# Altium schematic sheet CLKB_RS232_port.SchDoc
size A
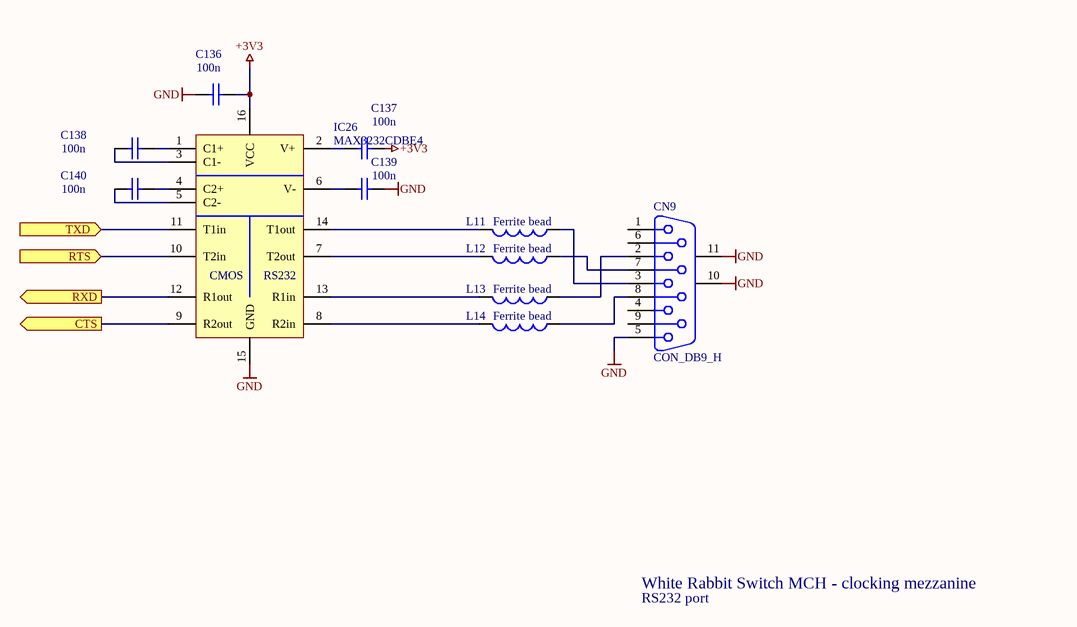
[diagram p0: CLKB_RS232_port.SchDoc]

## Parts
C136  100n  [CAPC1608X87N]
C137  100n  [CAPC1608X87N]
C138  100n  [CAPC1608X87N]
C139  100n  [CAPC1608X87N]
C140  100n  [CAPC1608X87N]
CN9  CON_DB9_H  [DSUB_MINI_9]
IC26  MAX3232CDBE4  [SSOP16]
L11  Ferrite bead  [L0603]
L12  Ferrite bead  [L0603]
L13  Ferrite bead  [L0603]
L14  Ferrite bead  [L0603]

## Ports
CTS (out), RTS (in), RXD (out), TXD (in)

## Nets
+3V3: C136.2 C137.2 IC26.16(VCC)
GND: C136.1 C139.2 CN9.5 CN9.10(MH1) CN9.11(MH2) IC26.15(GND)
CTS: IC26.9(R2out) ; port CTS
RTS: IC26.10(T2in) ; port RTS
RXD: IC26.12(R1out) ; port RXD
TXD: IC26.11(T1in) ; port TXD
NetC137_1: C137.1 IC26.2(V+)
NetC138_1: C138.1 IC26.3(C1-)
NetC138_2: C138.2 IC26.1(C1+)
NetC139_1: C139.1 IC26.6(V-)
NetC140_1: C140.1 IC26.5(C2-)
NetC140_2: C140.2 IC26.4(C2+)
NetCN9_2: CN9.2 L13.1
NetCN9_3: CN9.3 L11.1
NetCN9_7: CN9.7 L12.1
NetCN9_8: CN9.8 L14.1
NetIC26_7: IC26.7(T2out) L12.2
NetIC26_8: IC26.8(R2in) L14.2
NetIC26_13: IC26.13(R1in) L13.2
NetIC26_14: IC26.14(T1out) L11.2

Not connected (* = marked no-connect by the designer): CN9 1 4 6 9

## Notes on the sheet
- White Rabbit Switch MCH - clocking mezzanine
- RS232 port
- (in symbol IFC_MAX3232) CMOS; RS232

## Library data of the parts
C136-C140 = CC0603_100NF_50V_10%_X7R: Non-polarised capacitor; Part Description: SMD Multilayer Chip Ceramic Capacitor; Manufacturer: GENERIC; Manufacturer1 Part Number: 223858615649; Manufacturer1 Datasheet: \\cern.ch\dfs\Applications\Altium\Datasheets\CC0603_X7R_PHYCOMP.pdf; Value: 100nF; Voltage: 50V; TC: X7R; Tolerance: ±10%; Table: Capacitors SMD; Part Number: CC0603_100NF_50V_10%_X7R; Component Kind: Standard; Component Type: Standard; Designator: Capacitor - non polarized; Library Reference: Capacitor - non polarized; Pin Count: 2; Status: Preferred; Manufacturer Part Number: CC0603_100NF_50V_10%_X7R; Case: 0603; Mounted: Yes; Socket: No; SMD: Yes; Manufacturer1 Example: PHYCOMP; Manufacturer1 ComponentHeight: 0.87mm; HelpURL: \\cern.ch\dfs\Applications\Altium\Datasheets\CC0603_X7R_PHYCOMP.pdf; Author: CERN DEM JLC; CreateDate: 12/3/2007; LatestRevisionDate: 12/3/2007
CN9 = CON_DB9_H: Receptacle Assembly, 9 Position, Right Angle; Manufacturer: Generic Components; Package Information: Latest Revision: O; Class I: Connector; Positions: 9; RefId: 1263551; Value: MOLEX - 0836119006; Published: 15-Jun-2001; Revision: July-2002: Re-released for DXP Platform.; Datasheet: (1-Sep-1999); Package Reference: 788750; Publisher: Altium Limited; Orientation: Right Angle; Gender: Receptacle; Supplier: Farnell
IC26 = IFC_MAX3232: RefId: 1287435; Supplier: Farnell; Value: MAX3232CDBE4
L11-L14 = Inductor: Code_IEC: 1005; Published: 8-Jun-2000; LatestRevisionDate: 17-Jul-2002; LatestRevisionNote: Re-released for DXP Platform.; PackageReference: 0402-A; Publisher: Altium Limited; Code_JEITA: 0402